# Altium schematic sheet Connectivity.SchDoc
size A; DocumentNumber: 3; SheetNumber: 3; SheetTotal: 4
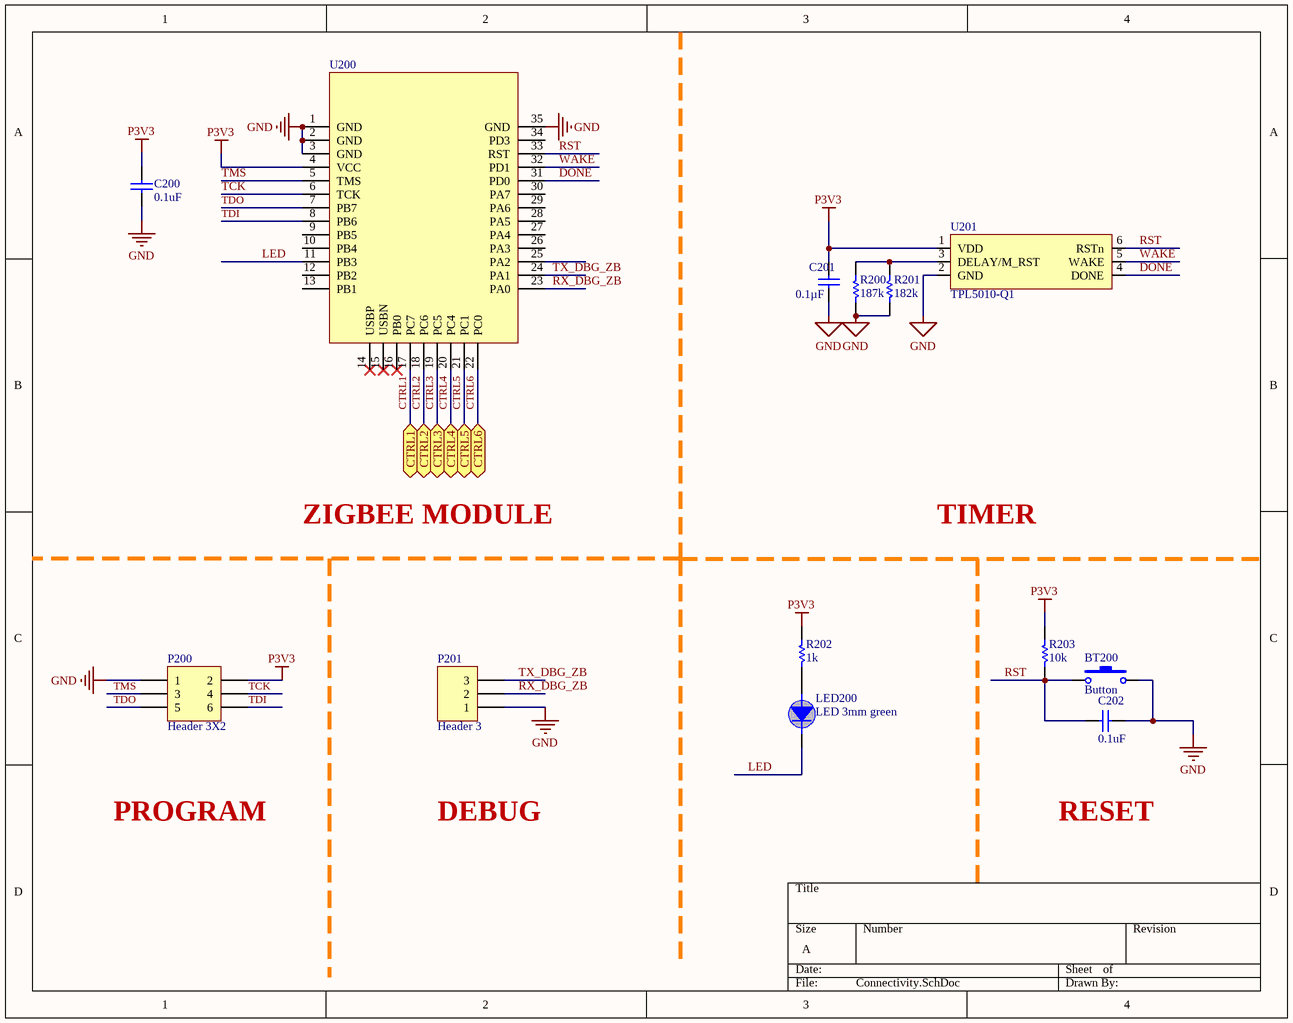
[diagram p0: Connectivity.SchDoc]

## Parts
BT200  Button  [SWSMD]
C200  0.1uF  [0805 cap]
C201  0.1µF  [0805 cap]
C202  0.1uF  [0805 cap]
LED200  LED 3mm green  [LED 3mm green]
P200  Header 3X2  [HDR2X3]
P201  Header 3  [HDR1X3]
R200  187k  [0805 Resistor]
R201  182k  [0805 Resistor]
R202  1k  [0805 Resistor]
R203  10k  [0805 Resistor]
U200  (no value)  [VZIGMOD2]
U201  TPL5010-Q1  [SOT23-6]

## Ports
CTRL1, CTRL2, CTRL3, CTRL4, CTRL5, CTRL6

## Nets
GND: BT200.2 C200.1 C201.1 C202.1 P200.1 P201.1 R200.1 R201.1 U200.1(GND) U200.2(GND) U200.3(GND) U200.35(GND) U201.2(GND)
P3V3: C200.2 C201.2 P200.2 R202.2 R203.2 U200.4(VCC) U201.1(VDD)
CTRL1: U200.17(PC7) ; port CTRL1
CTRL2: U200.18(PC6) ; port CTRL2
CTRL3: U200.19(PC5) ; port CTRL3
CTRL4: U200.20(PC4) ; port CTRL4
CTRL5: U200.21(PC1) ; port CTRL5
CTRL6: U200.22(PC0) ; port CTRL6
DONE: U200.31(PD0) U201.4(DONE)
LED: LED200.2(Katot) U200.11(PB3)
RST: BT200.1 C202.2 R203.1 U200.33(RST) U201.6(RSTn)
RX_DBG_ZB: P201.2 U200.23(PA0)
TCK: P200.4 U200.6(TCK)
TDI: P200.6 U200.8(PB6)
TDO: P200.5 U200.7(PB7)
TMS: P200.3 U200.5(TMS)
TX_DBG_ZB: P201.3 U200.24(PA1)
WAKE: U200.32(PD1) U201.5(WAKE)
NetLED200_1: LED200.1(anot) R202.1
NetR200_2: R200.2 R201.2 U201.3(DELAY/M_RST)

Not connected (* = marked no-connect by the designer): U200 9(PB5) 10(PB4) 12(PB2) 13(PB1) 14(USBP)* 15(USBN)* 16(PB0)* 25(PA2) 26(PA3) 27(PA4) 28(PA5) 29(PA6) 30(PA7) 34(PD3)

## Notes on the sheet
- ZIGBEE MODULE
- TIMER
- PROGRAM
- DEBUG
- RESET

## Library data of the parts
C200 = CAP0.1u0402: CAP CER 0.1UF 16V X7R 0402; Manufacturer: Samsung Electro-Mechanics; Manufacturer Part Number: CL05B104KO5NNNC; Tolerance: ±10%; Notification: Current market demand for these product types have resulted in fluctuating and extending lead times. Lead times may differ.; Module: Connectivity; Supplier 1: Digi-Key; Supplier Part Number 1: 1276-1001-6-ND; RoHS: RoHS Compliant; Category: Capacitors; Stock 1: 100000; Pricing 1: 1=0.1, 10=0.03, 100=0.0134, 500=0.00958, 1000=0.00753, 2500=0.00684, 5000=0.0063 (USD); Packaging: Digi-Reel®; Part Status: Active; Voltage - Rated: 16V; Temperature Coefficient: X7R; Operating Temperature: -55°C ~ 125°C; Features: -; Ratings: -; Applications: General Purpose; Mounting Type: Surface Mount, MLCC; Package / Case: 0402 (1005 Metric); Size / Dimension: 0.039" L x 0.020" W (1.00mm x 0.50mm); Height - Seated (Max): -; Thickness (Max): 0.022" (0.55mm); Lead Spacing: -; Lead Style: -; ComponentLink1URL: http://www.samsungsem.com/kr/support/product-search/mlcc/CL05B104KO5NNNC.jsp; ComponentLink1Description: http://www.samsungsem.com/kr/support/product-search/mlcc/CL05B104KO5NNNC.jsp
C201 = CAP0.1u0402: CAP CER 0.1UF 10V X7R 0402; Manufacturer: Taiyo Yuden; Manufacturer Part Number: LMK105B7104KVHF; Tolerance: ±10%; Supplier 1: Digi-Key; RoHS: RoHS Compliant; Category: Capacitors; Stock 1: 23930; Pricing 1: 1=0.1, 10=0.05, 100=0.0223, 500=0.01594, 1000=0.01252, 2500=0.01138, 5000=0.01047 (USD); Packaging: Cut Tape (CT); Part Status: Active; Capacitance: 0.1µF; Voltage - Rated: 10V; Temperature Coefficient: X7R; Operating Temperature: -55°C ~ 125°C; Features: -; Ratings: AEC-Q200; Applications: Automotive; Mounting Type: Surface Mount, MLCC; Package / Case: 0402 (1005 Metric); Size / Dimension: 0.039" L x 0.020" W (1.00mm x 0.50mm); Height - Seated (Max): -; Thickness (Max): 0.022" (0.55mm); Lead Spacing: -; Lead Style: -; ComponentLink1URL: http://www.yuden.co.jp/productdata/catalog/en/mlcc_all_hq_e.pdf; ComponentLink1Description: http://www.yuden.co.jp/productdata/catalog/en/mlcc_all_hq_e.pdf; Supplier Part Number 1: 587-3769-1-ND
C202 = cap SMD
P200 = Header 3X2: Header, 3-Pin, Dual row; LatestRevisionDate: 17-Jul-2002; LatestRevisionNote: Re-released for DXP Platform.; Publisher: Altium Limited
P201 = Header 3: Header, 3-Pin; LatestRevisionDate: 17-Jul-2002; LatestRevisionNote: Re-released for DXP Platform.; Publisher: Altium Limited
R200 = Resistor: RES SMD 187K OHM 1% 1/10W 0603; Manufacturer: Panasonic Electronic Components; Manufacturer Part Number: ERJ-3EKF1873V; Power (Watts): 0.1W, 1/10W; Temperature Coefficient: ±100ppm/°C; Supplier 1: Digi-Key; Supplier Part Number 1: P187KHCT-ND; RoHS: RoHS Compliant; Category: Resistors; Stock 1: 17711; Pricing 1: 1=0.1, 10=0.021, 100=0.0087, 1000=0.00389, 2500=0.00338 (USD); Packaging: Cut Tape (CT); Part Status: Active; Resistance (Ohms): 187k; Tolerance: ±1%; Composition: Thick Film; Features: Automotive AEC-Q200; Operating Temperature: -55°C ~ 155°C; Package / Case: 0603 (1608 Metric); Supplier Device Package: 0603; Size / Dimension: 0.063" L x 0.031" W (1.60mm x 0.80mm); Height - Seated (Max): 0.022" (0.55mm); Failure Rate: -; ComponentLink1URL: https://industrial.panasonic.com/cdbs/www-data/pdf/RDA0000/AOA0000C298.pdf; ComponentLink1Description: https://industrial.panasonic.com/cdbs/www-data/pdf/RDA0000/AOA0000C298.pdf
R201 = Resistor: RES SMD 182K OHM 1% 1/10W 0603; Manufacturer: Panasonic Electronic Components; Manufacturer Part Number: ERJ-3EKF1823V; Power (Watts): 0.1W, 1/10W; Temperature Coefficient: ±100ppm/°C; Supplier 1: Digi-Key; Supplier Part Number 1: P182KHCT-ND; RoHS: RoHS Compliant; Category: Resistors; Stock 1: 140068; Pricing 1: 1=0.1, 10=0.021, 100=0.0087, 1000=0.00389, 2500=0.00338 (USD); Packaging: Cut Tape (CT); Part Status: Active; Resistance (Ohms): 182k; Tolerance: ±1%; Composition: Thick Film; Features: Automotive AEC-Q200; Operating Temperature: -55°C ~ 155°C; Package / Case: 0603 (1608 Metric); Supplier Device Package: 0603; Size / Dimension: 0.063" L x 0.031" W (1.60mm x 0.80mm); Height - Seated (Max): 0.022" (0.55mm); Failure Rate: -; ComponentLink1URL: https://industrial.panasonic.com/cdbs/www-data/pdf/RDA0000/AOA0000C298.pdf; ComponentLink1Description: https://industrial.panasonic.com/cdbs/www-data/pdf/RDA0000/AOA0000C298.pdf
R202 R203 = Resistor
U200 = VZIGMOD2: VNPT ZIGBEE MODULE V1 - No-PA; Manufacturer: VNPT-Technology; Manufacturer Part Number: VZIGMOD1; Utilized IC / Part: CC2538; Catgory: RF/IF and RFID; Sensitivity: -99dBm; Data Rate: 250kbps; Frequency: 2.4GHz; Power - Output: 7dBm; Serial Interfaces: I²C, SPI, UART; Antenna Type: Integrated, PCB, External; Voltage - Supply: 1.85 V ~ 3.8 V; Module: Connectivity; Mounting Type: Surface Mount; Operating Temperature: -40°C ~ 85°C; Package / Case: 33-SMD Module
U201 = TPL5010: IC TIMER W/WATCHDOG 6SOT; Manufacturer: Texas Instruments; Manufacturer Part Number: TPL5010QDDCRQ1; Voltage - Supply: 1.8 V ~ 5 V; Current - Supply: 35nA; Supplier 1: Digi-Key; RoHS: RoHS Compliant; Category: Integrated Circuits (ICs); Stock 1: 2785; Pricing 1: 1=1.27, 10=1.136, 100=0.886, 500=0.73192, 1000=0.57783 (USD); Packaging: Cut Tape (CT); Part Status: Active; Type: Programmable Timer; Count: -; Frequency: -; Operating Temperature: -40°C ~ 125°C; Package / Case: SOT-23-6 Thin, TSOT-23-6; Supplier Device Package: TSOT-23-6; Mounting Type: Surface Mount; ComponentLink1URL: http://www.ti.com/lit/ds/symlink/tpl5010-q1.pdf; ComponentLink1Description: http://www.ti.com/lit/ds/symlink/tpl5010-q1.pdf; Supplier Part Number 1: 296-44963-1-ND